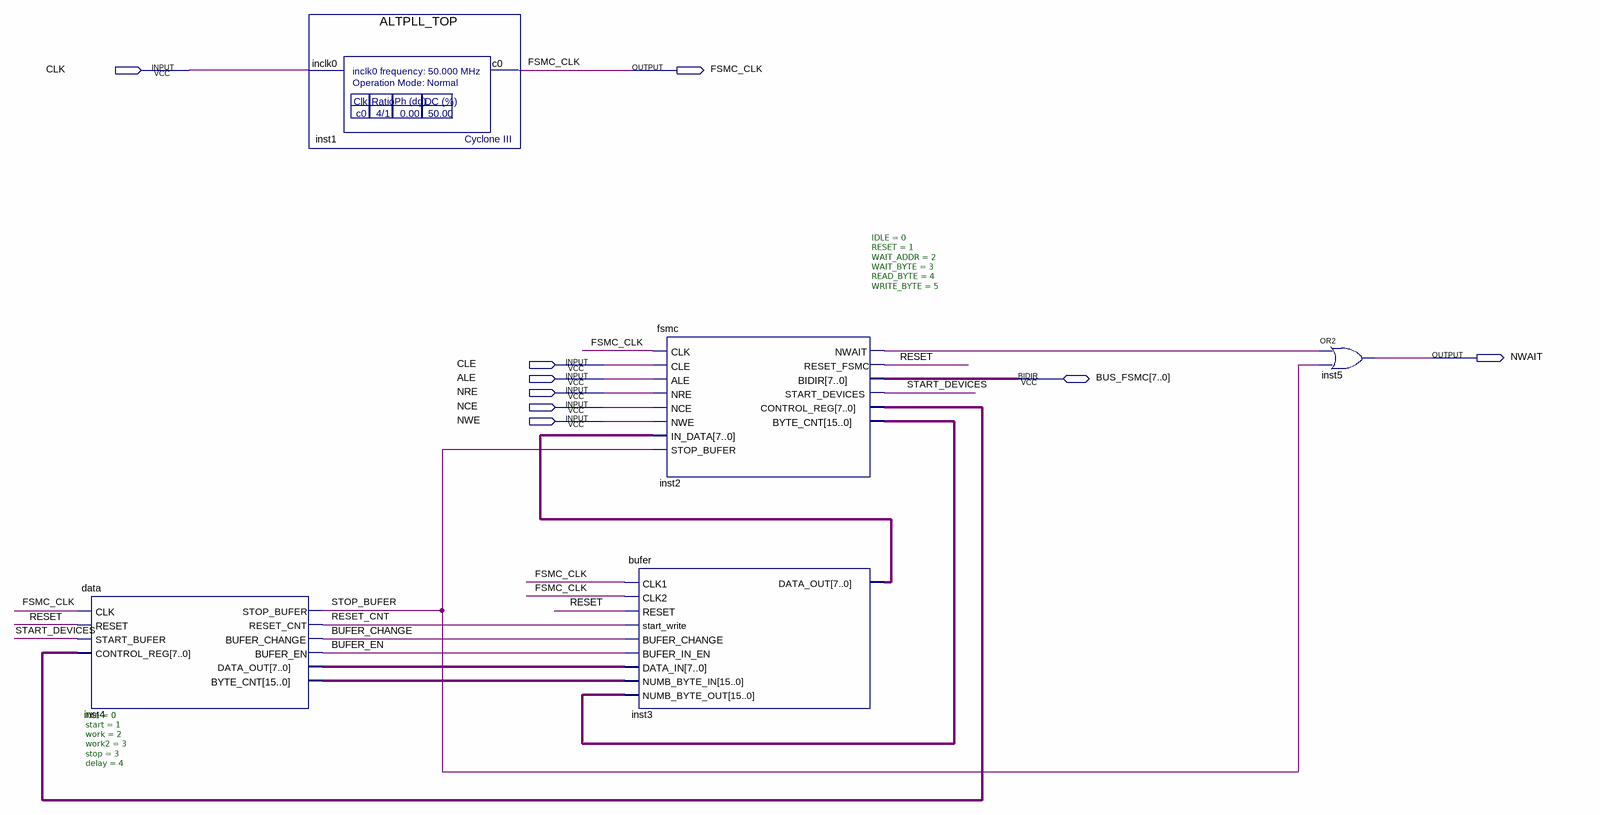
[diagram p0: schematic sheet]
// Quartus schematic GIRAFFE_TOP.bdf as structural Verilog: 5 symbols, 9 pins
module GIRAFFE_TOP (
  input  CLK,
  input  CLE,
  input  ALE,
  input  NRE,
  input  NCE,
  input  NWE,
  inout  [7:0] BUS_FSMC,
  output FSMC_CLK,
  output NWAIT
);

  wire BUFER_CHANGE, BUFER_EN, inst2_nwait, RESET, RESET_CNT, START_DEVICES, STOP_BUFER;
  wire [7:0] inst2_control_reg, inst3_data_out, inst4_data_out;
  wire [15:0] inst2_byte_cnt, inst4_byte_cnt;

  data #(.idle(0), .start(1), .work(2), .work2(3), .stop(3), .delay(4)) inst4 (
    .CLK(FSMC_CLK), .RESET(RESET), .START_BUFER(START_DEVICES), .CONTROL_REG(inst2_control_reg),
    .STOP_BUFER(STOP_BUFER), .RESET_CNT(RESET_CNT), .BUFER_CHANGE(BUFER_CHANGE), .BUFER_EN(BUFER_EN),
    .DATA_OUT(inst4_data_out), .BYTE_CNT(inst4_byte_cnt));
  ALTPLL_TOP inst1 (.inclk0(CLK), .c0(FSMC_CLK));
  bufer inst3 (
    .CLK1(FSMC_CLK), .CLK2(FSMC_CLK), .RESET(RESET), .start_write(RESET_CNT), .BUFER_CHANGE(BUFER_CHANGE),
    .BUFER_IN_EN(BUFER_EN), .DATA_IN(inst4_data_out), .NUMB_BYTE_IN(inst4_byte_cnt),
    .NUMB_BYTE_OUT(inst2_byte_cnt), .DATA_OUT(inst3_data_out));
  fsmc #(.IDLE(0), .RESET(1), .WAIT_ADDR(2), .WAIT_BYTE(3), .READ_BYTE(4), .WRITE_BYTE(5)) inst2 (
    .CLK(FSMC_CLK), .CLE(CLE), .ALE(ALE), .NRE(NRE), .NCE(NCE), .NWE(NWE), .IN_DATA(inst3_data_out),
    .STOP_BUFER(STOP_BUFER), .NWAIT(inst2_nwait), .RESET_FSMC(RESET), .START_DEVICES(START_DEVICES),
    .CONTROL_REG(inst2_control_reg), .BYTE_CNT(inst2_byte_cnt), .BIDIR(BUS_FSMC));
  or inst5 (NWAIT, inst2_nwait, STOP_BUFER);
endmodule
